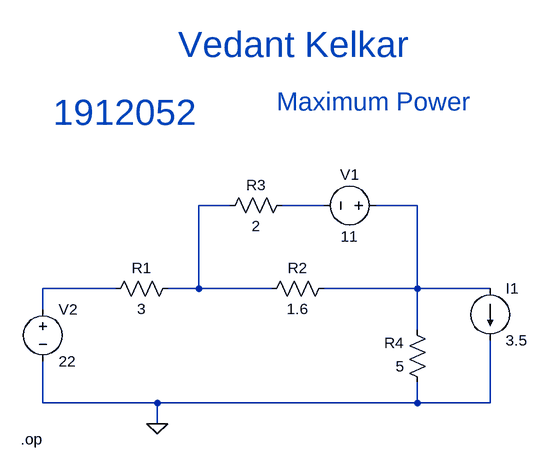
[diagram p0: schematic Draft2.asc]
Draft2.asc, the LTspice schematic file:
Version 4
SHEET 1 1956 680
WIRE 224 -96 176 -96
WIRE 368 -96 304 -96
WIRE 512 -96 448 -96
WIRE 48 32 -64 32
WIRE 176 32 176 -96
WIRE 176 32 128 32
WIRE 288 32 176 32
WIRE 512 32 512 -96
WIRE 512 32 368 32
WIRE 624 32 512 32
WIRE -64 64 -64 32
WIRE 512 96 512 32
WIRE -64 208 -64 144
WIRE 112 208 -64 208
WIRE 512 208 512 176
WIRE 512 208 112 208
WIRE 624 208 624 112
WIRE 624 208 512 208
WIRE 112 240 112 208
FLAG 112 240 0
SYMBOL res 32 48 R270
WINDOW 0 32 56 VTop 2
WINDOW 3 0 56 VBottom 2
SYMATTR InstName R1
SYMATTR Value 3
SYMBOL res 272 48 R270
WINDOW 0 32 56 VTop 2
WINDOW 3 0 56 VBottom 2
SYMATTR InstName R2
SYMATTR Value 1.6
SYMBOL res 208 -80 R270
WINDOW 0 32 56 VTop 2
WINDOW 3 0 56 VBottom 2
SYMATTR InstName R3
SYMATTR Value 2
SYMBOL res 528 192 R180
WINDOW 0 36 76 Left 2
WINDOW 3 36 40 Left 2
SYMATTR InstName R4
SYMATTR Value 5
SYMBOL voltage -64 48 R0
WINDOW 123 0 0 Left 0
WINDOW 39 0 0 Left 0
SYMATTR InstName V2
SYMATTR Value 22
SYMBOL voltage 464 -96 R90
WINDOW 0 -32 56 VBottom 2
WINDOW 3 32 56 VTop 2
WINDOW 123 0 0 Left 0
WINDOW 39 0 0 Left 0
SYMATTR InstName V1
SYMATTR Value 11
SYMBOL current 624 32 R0
WINDOW 123 0 0 Left 0
WINDOW 39 0 0 Left 0
SYMATTR InstName I1
SYMATTR Value 3.5
TEXT 144 -344 Left 5 ;Vedant Kelkar
TEXT -48 -240 Left 5 ;1912052
TEXT 296 -256 Left 4 ;Maximum Power
TEXT -98 264 Left 2 !.op

The netlist it stands for:
* Draft2.asc
R1 N004 N001 3
R2 N001 N003 1.6
R3 N001 N002 2
R4 0 N003 5
V2 N004 0 22
V1 N003 N002 11
I1 N003 0 3.5
* Vedant Kelkar
* 1912052
* Maximum Power
.op
.backanno
.end